# EAGLE design booz_imu_yz (EAGLE 5.04)
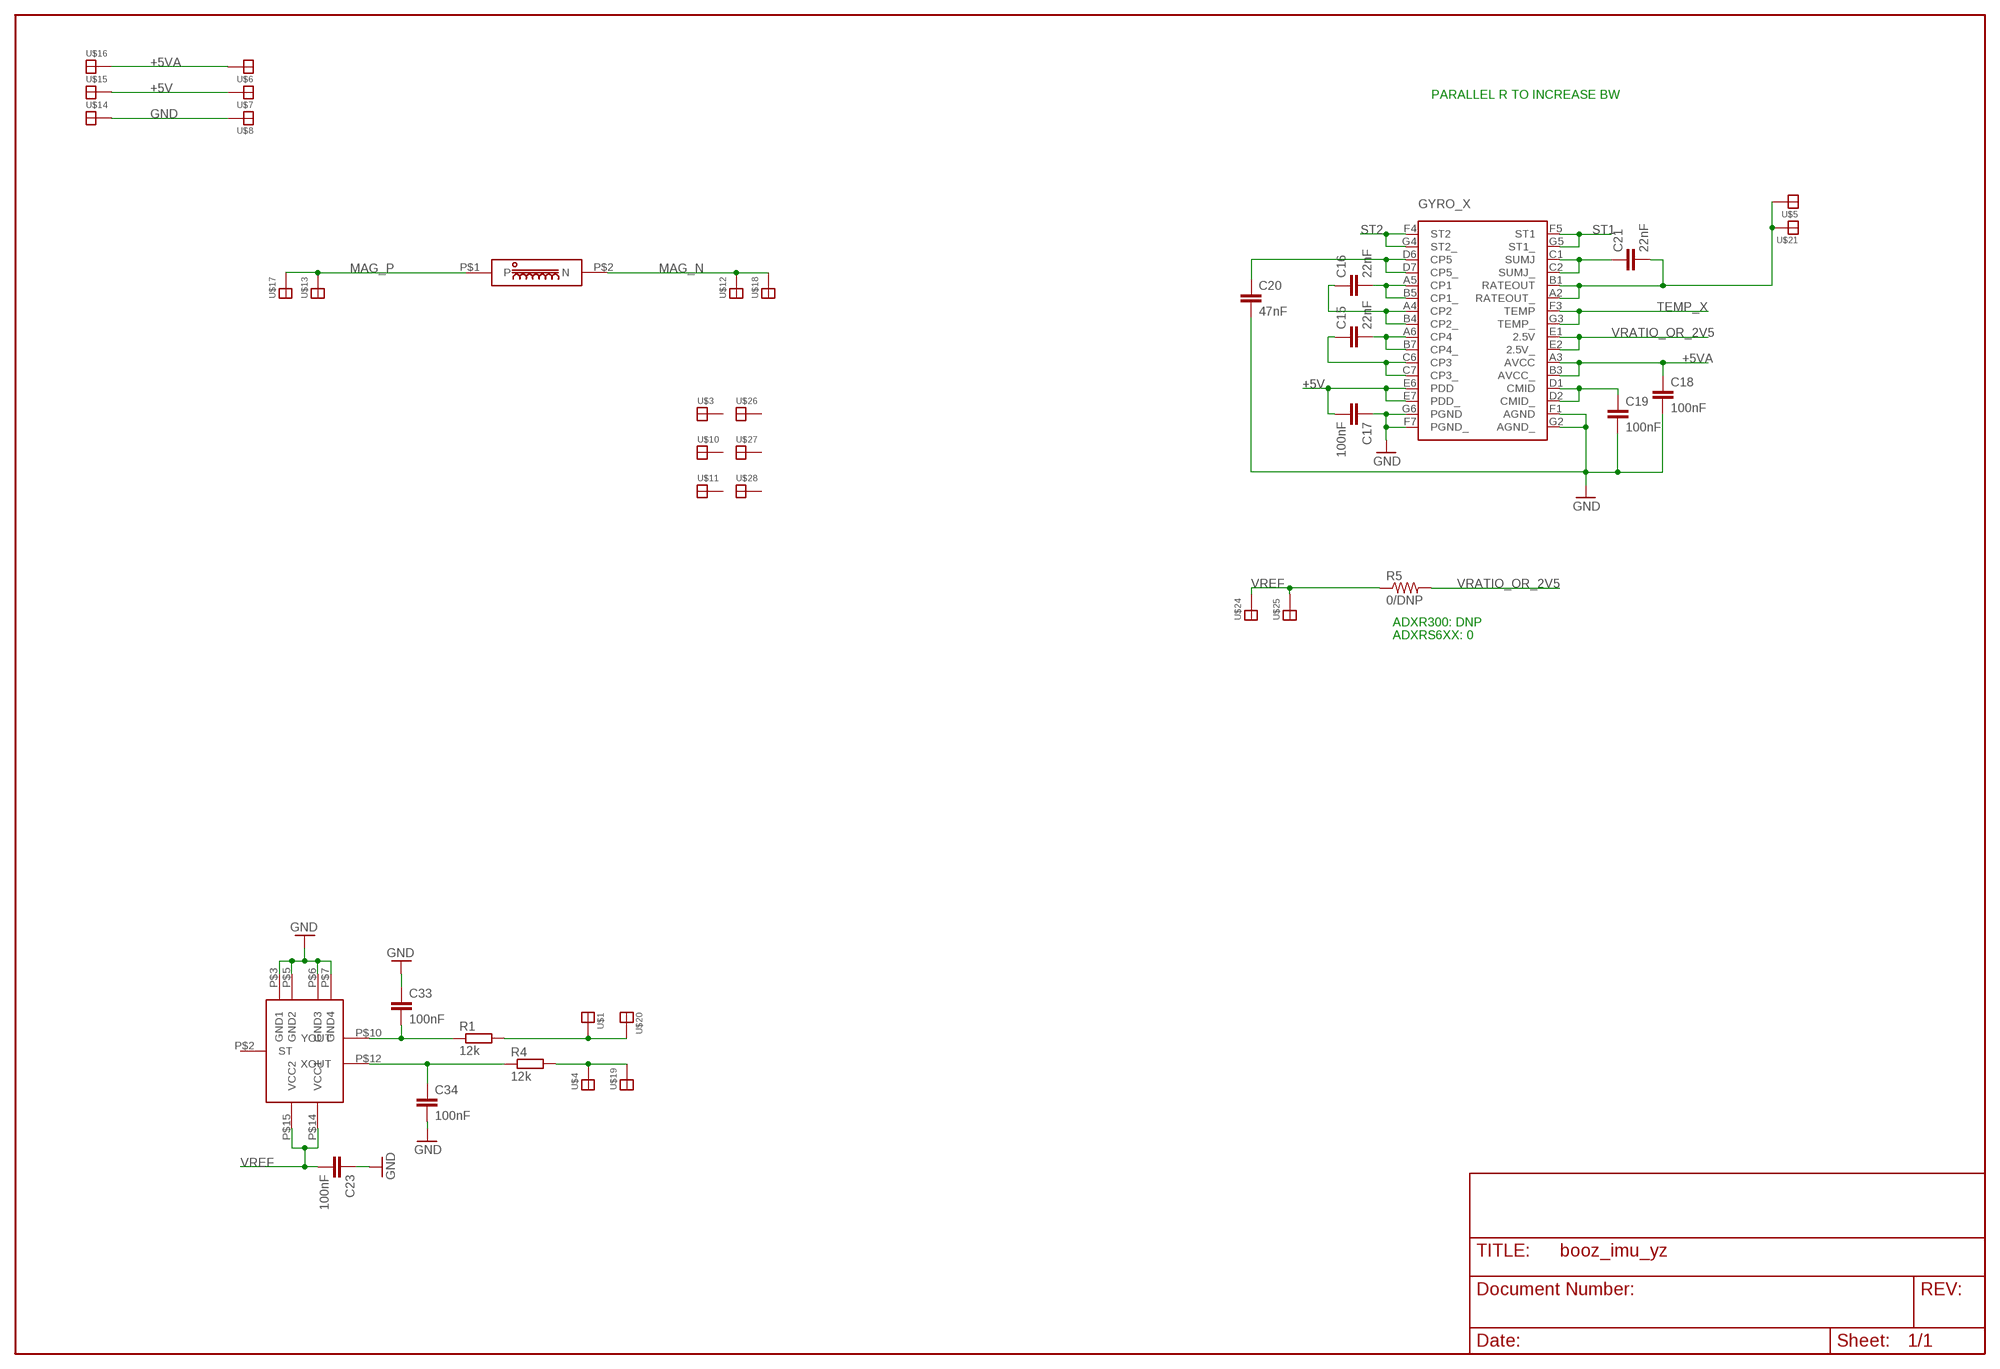
[diagram p0: schematic, sheet 1]

## Parts
C15  22nF  C-EUC0603K  [C0603K]
C16  22nF  C-EUC0603K  [C0603K]
C17  100nF  C-EUC0603K  [C0603K]
C18  100nF  C-EUC0603K  [C0603K]
C19  100nF  C-EUC0603K  [C0603K]
C20  47nF  C-EUC0603K  [C0603K]
C21  22nF  C-EUC0603K  [C0603K]
C23  100nF  C-EUC0603K  [C0603K]
C33  100nF  C-EUC0603K  [C0603K]
C34  100nF  C-EUC0603K  [C0603K]
GYRO_X  ADXR  [BC-32]
R1  12k  R-EU_R0603  [R0603]
R4  12k  R-EU_R0603  [R0603]
R5  0/DNP  R-US_R0603  [R0603]
U$1  SOLDER_PAD  [SOLDER_PAD]
U$2  ADXL320  [LSCFP]
U$3  SOLDER_PAD  [SOLDER_PAD]
U$4  SOLDER_PAD  [SOLDER_PAD]
U$5  SOLDER_PAD  [SOLDER_PAD]
U$6  SOLDER_PAD  [SOLDER_PAD]
U$7  SOLDER_PAD  [SOLDER_PAD]
U$8  SOLDER_PAD  [SOLDER_PAD]
U$9  SEN_XY  [SEN_XY]
U$10  SOLDER_PAD  [SOLDER_PAD]
U$11  SOLDER_PAD  [SOLDER_PAD]
U$12  SOLDER_PAD  [SOLDER_PAD]
U$13  SOLDER_PAD  [SOLDER_PAD]
U$14  SOLDER_PAD  [SOLDER_PAD]
U$15  SOLDER_PAD  [SOLDER_PAD]
U$16  SOLDER_PAD  [SOLDER_PAD]
U$17  SOLDER_PAD  [SOLDER_PAD]
U$18  SOLDER_PAD  [SOLDER_PAD]
U$19  SOLDER_PAD  [SOLDER_PAD]
U$20  SOLDER_PAD  [SOLDER_PAD]
U$21  SOLDER_PAD  [SOLDER_PAD]
U$24  SOLDER_PAD  [SOLDER_PAD]
U$25  SOLDER_PAD  [SOLDER_PAD]
U$26  SOLDER_PAD  [SOLDER_PAD]
U$27  SOLDER_PAD  [SOLDER_PAD]
U$28  SOLDER_PAD  [SOLDER_PAD]

## Nets
+5V: C17.2 GYRO_X.E6(PDD) GYRO_X.E7(PDD_) U$7.P$1 U$15.P$1
+5VA: C18.1 GYRO_X.A3(AVCC) GYRO_X.B3(AVCC_) U$6.P$1 U$16.P$1
ACCEL_H: R4.2 U$4.P$1 U$19.P$1
ACCEL_V: R1.2 U$1.P$1 U$20.P$1
GND: C17.1 C18.2 C19.2 C20.2 C23.1 C33.1 C34.2 GYRO_X.F1(AGND) GYRO_X.F7(PGND_) GYRO_X.G2(AGND_) GYRO_X.G6(PGND) U$2.P$3(GND1) U$2.P$5(GND2) U$2.P$6(GND3) U$2.P$7(GND4) U$8.P$1 U$14.P$1
MAG_N: U$9.P$2(N) U$12.P$1 U$18.P$1
MAG_P: U$9.P$1(P) U$13.P$1 U$17.P$1
N$6: C21.1 GYRO_X.C1(SUMJ) GYRO_X.C2(SUMJ_)
N$7: C15.1 GYRO_X.C6(CP3) GYRO_X.C7(CP3_)
N$11: C20.1 GYRO_X.D6(CP5) GYRO_X.D7(CP5_)
N$12: C16.2 GYRO_X.A5(CP1) GYRO_X.B5(CP1_)
N$13: C16.1 GYRO_X.A4(CP2) GYRO_X.B4(CP2_)
N$14: C15.2 GYRO_X.A6(CP4) GYRO_X.B7(CP4_)
N$19: C19.1 GYRO_X.D1(CMID) GYRO_X.D2(CMID_)
N$20: C33.2 R1.1 U$2.P$10(YOUT)
N$32: C34.1 R4.1 U$2.P$12(XOUT)
RATE_X: C21.2 GYRO_X.A2(RATEOUT_) GYRO_X.B1(RATEOUT) U$5.P$1 U$21.P$1
ST1: GYRO_X.F5(ST1) GYRO_X.G5(ST1_)
ST2: GYRO_X.F4(ST2) GYRO_X.G4(ST2_)
TEMP_X: GYRO_X.F3(TEMP) GYRO_X.G3(TEMP_)
VRATIO_OR_2V5: GYRO_X.E1(2.5V) GYRO_X.E2(2.5V_) R5.2
VREF: C23.2 R5.1 U$2.P$14(VCC1) U$2.P$15(VCC2) U$24.P$1 U$25.P$1
Unconnected: U$2.P$2(ST) U$3.P$1 U$10.P$1 U$11.P$1 U$26.P$1 U$27.P$1 U$28.P$1

## Notes on the sheet
- PARALLEL R TO INCREASE BW
- ADXR300: DNP
- ADXRS6XX: 0

## Library data of the parts
C15-C21 C23 C33 C34 = rcl:C-EU: CAPACITOR, European symbol
GYRO_X = paparazzi:ADXR
R1 R4 = rcl:R-EU_: RESISTOR, European symbol
R5 = rcl:R-US_: RESISTOR, American symbol
U$1 U$3-U$8 U$10-U$21 U$24-U$28 = paparazzi:SOLDER_PAD
U$2 = paparazzi:ADXL320
U$9 = booz:SEN_XY

## Board
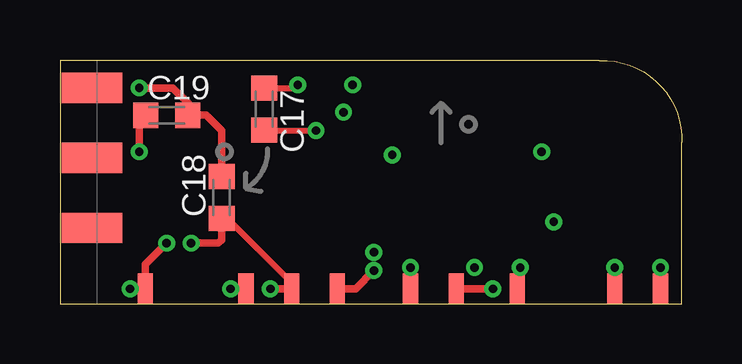
[diagram p1: board, top side]
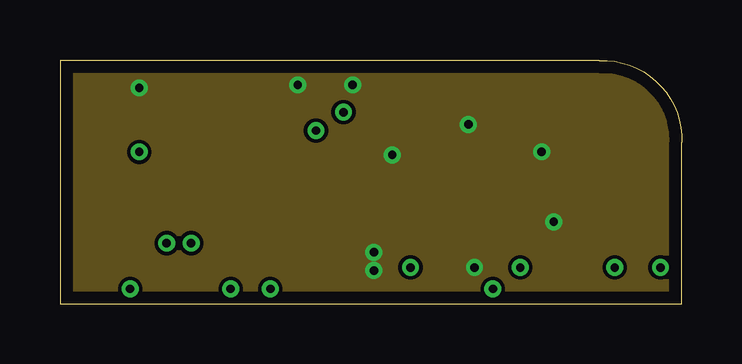
[diagram p2: board, inner layer Route2]
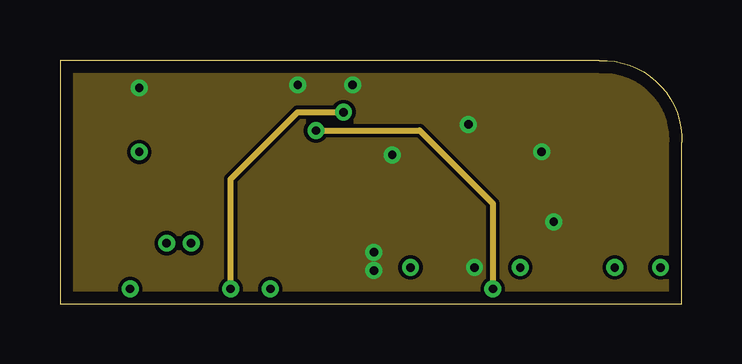
[diagram p3: board, inner layer Route15]
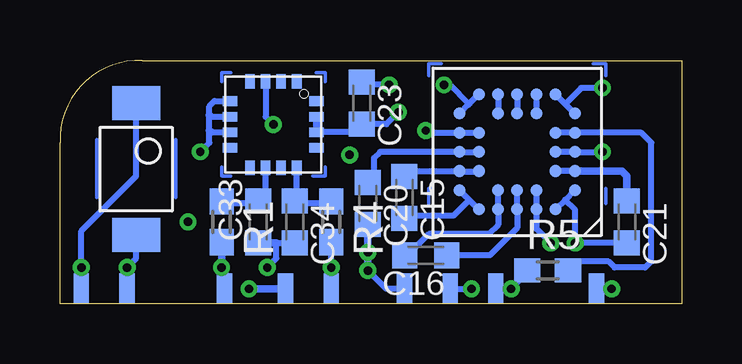
[diagram p4: board, bottom side, seen from below]

Size 25.91 x 10.16 mm. Coordinates in mm from the lower left corner, seen from the top.
Outline: 0,0 25.91,0 25.91,6.73 arc95 22.48,10.16 0,10.16 0,0
Copper layers (1*2+15*16): Top 0.035mm / dielectric 0.2mm / Route2 0.035mm / dielectric 1.5mm / Route15 0.035mm / dielectric 0.2mm / Bottom 0.035mm
Design rules "eurocircuits_verified_4l": minimum track width 0.15mm, minimum drill 0.35mm, track to track 0.15mm, track to pad 0.15mm, pad to pad 0.15mm, via to via 0.15mm, smd to smd 0.15mm, copper to edge 20mil, drill to drill 8mil, minimum pad ring 0.177mm, minimum via ring 0.177mm, stop-mask expansion 4mil, vias tented up to drill 14mil, thermal gap 10mil

### Footprints (pad centres in the part's own frame; a part is rotated, then mirrored left to right if it is on the bottom)
C0603K = smd 1.05 x 1.08: 1 -0.875,0; 2 0.875,0
BC-32 = smd 0.5 x 0.5: A2 -1.6,2.4; A3 -0.8,2.4; A4 0,2.4; A5 0.8,2.4; A6 1.6,2.4; B1 -2.4,1.6; B3 -0.8,1.6; B4 0,1.6; B5 0.8,1.6; B7 2.4,1.6; C1 -2.4,0.8; C2 -1.6,0.8; C6 1.6,0.8; C7 2.4,0.8; D1 -2.4,0; D2 -1.6,0; D6 1.6,0; D7 2.4,0; E1 -2.4,-0.8; E2 -1.6,-0.8; E6 1.6,-0.8; E7 2.4,-0.8; F1 -2.4,-1.6; F3 -0.8,-1.6; F4 0,-1.6; F5 0.8,-1.6; F7 2.4,-1.6; G2 -1.6,-2.4; G3 -0.8,-2.4; G4 0,-2.4; G5 0.8,-2.4; G6 1.6,-2.4
R0603 = smd 1.1 x 1: 1 -0.85,0; 2 0.85,0
SOLDER_PAD = smd 0.635 x 1.27: P$1 0,0
LSCFP = smd 0.6 x 0.4: P$1 -1.8,0.975; P$2 -1.8,0.325; P$3 -1.8,-0.325; P$4 -1.8,-0.975; P$9 1.8,-0.975; P$10 1.8,-0.325; P$11 1.8,0.325; P$12 1.8,0.975 | smd 0.4 x 0.6: P$5 -0.975,-1.8; P$6 -0.325,-1.8; P$7 0.325,-1.8; P$8 0.975,-1.8; P$13 0.975,1.8; P$14 0.325,1.8; P$15 -0.325,1.8; P$16 -0.975,1.8
SEN_XY = smd 1.4 x 2: P$1 0,0; P$2 5.5,0

### Placement (x,y rotation side)
C15  11.56,4.45 270 bottom
C16  10.67,2.03 180 bottom
C17  8.51,8.13 270 top
C18  6.73,4.45 90 top
C19  4.45,7.87 0 top
C20  13.08,4.19 270 bottom
C21  2.29,3.43 270 bottom
C23  13.33,8.38 270 bottom
C33  17.65,3.43 90 bottom
C34  16.13,3.43 270 bottom
GYRO_X  6.86,6.35 180 bottom
R1  19.18,3.43 270 bottom
R4  14.6,3.43 270 bottom
R5  5.59,1.4 0 bottom
U$1  19.05,0.64 0 top
U$2  17.02,7.49 270 bottom
U$3  1.65,9.02 0 top
U$4  14.6,0.64 0 top
U$5  3.56,0.64 0 top
U$6  9.65,0.64 0 top
U$7  16.51,0.64 0 top
U$8  11.56,0.64 0 top
U$9  22.73,8.38 270 bottom
U$10  1.65,6.1 0 top
U$11  1.65,3.17 0 top
U$12  23.11,0.64 0 top
U$13  25.02,0.64 0 top
U$14  11.56,0.64 0 bottom
U$15  16.51,0.64 0 bottom
U$16  9.65,0.64 0 bottom
U$17  25.02,0.64 0 bottom
U$18  23.11,0.64 0 bottom
U$19  14.6,0.64 0 bottom
U$20  19.05,0.64 0 bottom
U$21  3.56,0.64 0 bottom
U$22  SOLDER_PAD  [SOLDER_PAD]  1.02,9.02 0 top
U$23  SOLDER_PAD  [SOLDER_PAD]  1.02,6.1 0 top
U$24  7.75,0.64 0 bottom
U$25  7.75,0.64 0 top
U$26  2.29,9.02 0 top
U$27  2.29,6.1 0 top
U$28  2.29,3.17 0 top
U$29  SOLDER_PAD  [SOLDER_PAD]  1.02,3.17 0 top
U$30  SOLDER_PAD  [SOLDER_PAD]  0.38,9.02 0 top
U$31  SOLDER_PAD  [SOLDER_PAD]  0.38,6.1 0 top
U$32  SOLDER_PAD  [SOLDER_PAD]  0.38,3.17 0 top

### Tracks (layer width: path | path; a pad name or v marks a point on that pad's centre or on a via)
+5V  (via drill 0.35)
  Top 0.254: C17.2 8.51,7.24 v10.67,7.24
  Top 0.305: v18.03,0.64 U$15.P$1
  Route15 0.254: v18.03,0.64 18.03,4.19 14.99,7.24 v10.67,7.24
  Bottom 0.203: 9.25,7.16 GYRO_X.E7 | GYRO_X.E6
  Bottom 0.254: 9.25,7.16 GYRO_X.E6 | GYRO_X.E7 10.58,7.15 v10.67,7.24
  Bottom 0.305: v18.03,0.64 U$15.P$1 | 8.41,7.14 8.42,7.15 GYRO_X.E6
+5VA  (via drill 0.35)
  Top 0.254: 6.73,3.56 6.98,3.56 9.65,0.89 U$16.P$1
  Top 0.305: v8.76,0.64 U$16.P$1 | v5.46,2.54 6.6,2.54 6.73,2.67 6.73,3.56 C18.1
  Bottom 0.203: 6.04,3.96 6.05,3.96 GYRO_X.A3 | 6.04,4.74 GYRO_X.B3
  Bottom 0.254: 6.04,4.74 6.04,3.96 6.04,3.12 v5.46,2.54 | U$16.P$1 v8.76,0.64
ACCEL_H  (via drill 0.35)
  Top 0.305: v14.6,1.52 U$19.P$1
  Bottom 0.254: v14.6,1.52 R4.2
  Bottom 0.305: U$19.P$1 v14.6,1.52
ACCEL_V  (via drill 0.35)
  Top 0.305: v19.18,1.52 19.05,1.27 U$20.P$1
  Bottom 0.305: R1.2 v19.18,1.52 19.05,1.4 U$20.P$1
GND  (via drill 0.35)
  Top 0.254: C17.1 9.77,9 v9.91,9.14
  Top 0.305: v3.3,9.02 4.7,9.02 5.33,8.38 5.33,7.87 6.1,7.87 6.73,7.24 C18.2 | U$14.P$1 12.32,0.64 v13.08,1.4 | C17.1 8.51,9.02 8.89,9.02
  Top 0.406: 5.33,7.87 C19.2
  Bottom 0.203: GYRO_X.F7 9.25,7.96 9.25,7.98 9.23,7.98 | GYRO_X.G2 5.26,8.74 5.25,8.74 | GYRO_X.G2
  Bottom 0.254: 4.86,8.35 5.25,8.74 | 4.86,8.35 GYRO_X.F1 | C34.2 16.89,2.55 16.89,1.91 v17.27,1.52 | v3.3,9.02 4.19,9.02 4.86,8.35 | v13.08,1.4 12.32,0.64 U$14.P$1 | U$2.P$5 19.47,8.47 19.69,8.25 19.69,7.87 19.69,7.24 19.69,6.73 v20.07,6.35 | 19.61,7.17 U$2.P$7 | 19.63,7.82 U$2.P$6 | U$2.P$3 17.34,7.82 v17.02,7.49 | v12.19,9.14 13.33,9.14 | GYRO_X.G6 8.83,8.38 8.89,8.38 | GYRO_X.F7 8.89,8.32 8.89,8.38 | 8.89,8.38 9.65,9.14 v9.91,9.14
  Bottom 0.305: 16.89,2.55 C33.1 | GYRO_X.F7 9.27,7.96 9.27,8 9.21,8 | v13.08,1.4 v13.08,2.16 C20.2 | 19.69,7.24 19.61,7.17 | 19.69,7.87 19.63,7.82 | 13.33,9.14 C23.1
  other vias: 13.84,6.22 20.57,3.43
  pour Route2: -0.25,10.03 25.78,10.03 25.78,0.13 -0.25,0.13
  pour Route15: -0.25,10.03 25.78,10.03 25.78,0.13 -0.25,0.13
MAG_N  (via drill 0.35)
  Top 0.254: v23.11,1.52 U$18.P$1
  Bottom 0.254: U$18.P$1 v23.11,1.52 22.73,1.91 U$9.P$2 22.73,2.92
MAG_P  (via drill 0.35)
  Top 0.254: v25.02,1.52 U$17.P$1
  Bottom 0.254: U$17.P$1 v25.02,1.52 25.02,3.05 22.73,5.33 U$9.P$1
N$1
  Bottom 0.152: 3.18,4.19 3.18,4.83
N$2
  Bottom 0.152: 10.03,10.03 10.54,10.03 10.54,9.52
N$3
  Bottom 0.152: 3.68,10.03 3.18,10.03 3.18,9.52
N$4
  Bottom 0.152: 10.54,4.19 10.54,4.83
N$5
  Bottom 0.152: 15.24,9.65 14.86,9.65 14.86,9.27
N$6
  Bottom 0.203: GYRO_X.C2 | GYRO_X.C2 5.26,5.56
  Bottom 0.254: GYRO_X.C1 GYRO_X.C2 | C21.1 2.29,4.19
  Bottom 0.305: GYRO_X.C1 2.5,5.55 2.29,5.33 C21.1
N$7
  Bottom 0.203: 9.27,5.54 | GYRO_X.C7 9.27,5.54 | GYRO_X.C6
  Bottom 0.254: GYRO_X.C6 9.27,5.54 10.34,5.54 11.35,5.54 C15.1
N$8
  Bottom 0.152: 18.8,9.65 19.18,9.65 19.18,9.27
N$9
  Bottom 0.152: 19.18,5.72 19.18,5.33 18.8,5.33
N$10
  Bottom 0.152: 15.37,5.33 14.86,5.33 14.86,5.72
N$11
  Bottom 0.254: GYRO_X.D6 GYRO_X.D7 12.06,6.35 12.57,6.35 12.83,6.1 12.83,5.33 13.08,5.08
  Bottom 0.305: C20.1 13.08,5.08 13.08,5.33
N$12
  Bottom 0.203: 7.64,3.94 | GYRO_X.A5 7.64,3.94 | 7.64,4.74 GYRO_X.B5
  Bottom 0.254: 7.64,3.94 7.64,4.74 | GYRO_X.A5 7.66,3.3 8.04,2.92 9.02,2.92 10.54,2.92 11.43,2.03 C16.2
N$13
  Bottom 0.254: GYRO_X.B4 GYRO_X.A4 6.86,3.17 8,2.03 C16.1
N$14
  Bottom 0.203: GYRO_X.B7 9.25,4.75 9.25,4.74 | GYRO_X.B7
  Bottom 0.254: GYRO_X.A6 8.86,4.35 | 8.86,4.35 9.25,4.74 | 8.86,4.35 9.53,3.68 11.44,3.68 C15.2 11.56,3.43 11.54,3.43
N$15
  Bottom 0.152: 21.08,4.45 21.08,6.86
N$16
  Bottom 0.152: 24.38,4.45 24.38,6.86
N$19  (via drill 0.35)
  Top 0.305: C19.1 3.56,7.87 3.68,7.87 3.3,7.49 v3.3,6.35
  Bottom 0.254: GYRO_X.D2 GYRO_X.D1 v3.3,6.35
N$20
  Bottom 0.254: C33.2 17.65,4.19 19.3,4.19 19.18,4.32 R1.1 | 17.34,4.45 U$2.P$10
  Bottom 0.305: 17.65,4.32 C33.2 17.65,4.45 17.34,4.45
N$32
  Bottom 0.254: C34.1 16.13,4.19 16.09,4.15 16,4.15 15.87,4.15 | 14.6,4.19 15.84,4.19 | 16.04,4.19 U$2.P$12
  Bottom 0.305: 15.92,4.23 15.87,4.19 15.87,4.15 15.84,4.19 | R4.1 14.6,4.19 | 16,4.15 16,4.19 16.04,4.19
RATE_X  (via drill 0.35)
  Top 0.254: U$21.P$1 v2.92,0.64
  Top 0.305: U$21.P$1 3.56,1.65 v4.45,2.54
  Bottom 0.203: GYRO_X.A2 5.27,3.94 5.28,3.94
  Bottom 0.254: v2.92,0.64 U$21.P$1 | 4.86,4.35 GYRO_X.B1 | 4.86,4.35 5.27,3.94 | 2.29,2.54 v4.45,2.54 4.45,3.94 4.86,4.35
  Bottom 0.305: C21.2 2.29,2.54
ST1
  Bottom 0.203: 7.64,7.95 GYRO_X.F5 | GYRO_X.F5 | GYRO_X.G5 7.64,8.74
  Bottom 0.254: 7.64,8.74 7.64,7.95
ST2
  Bottom 0.254: GYRO_X.G4 GYRO_X.F4
TEMP_X
  Bottom 0.203: GYRO_X.F3 | GYRO_X.F3 | GYRO_X.G3 6.07,8.74
  Bottom 0.254: 6.07,8.74 GYRO_X.F3
VRATIO_OR_2V5
  Bottom 0.254: R5.2 4.74,1.36 4.32,1.78 3.05,1.78 2.79,1.52 1.52,1.52 1.27,1.78 1.27,6.73 1.69,7.15 GYRO_X.E1 4.46,7.13 | 4.46,7.13 4.45,7.11 | GYRO_X.E2 4.48,7.15 4.46,7.13
VREF  (via drill 0.35)
  Top 0.305: v7.11,0.64 U$25.P$1
  Route15 0.254: v7.11,0.64 7.11,5.21 9.91,8 v11.81,8
  Bottom 0.254: U$25.P$1 v7.11,0.64 6.48,1.27 R5.1 | U$2.P$14 15.22,7.13 15.24,7.11 | 13.33,7.17 15.17,7.17 | C23.2 12.31,7.51 v11.81,8
  Bottom 0.305: C23.2 13.33,7.37 | 13.33,7.37 13.21,7.24 | U$2.P$14 15.17,7.17 15.22,7.22 15.22,7.73 15.24,7.75 15.22,7.77 U$2.P$15 | 13.33,7.37 13.33,7.17

### Text on the board
tDocu: q | Az